# EAGLE design vending machine (EAGLE 9.6.2)
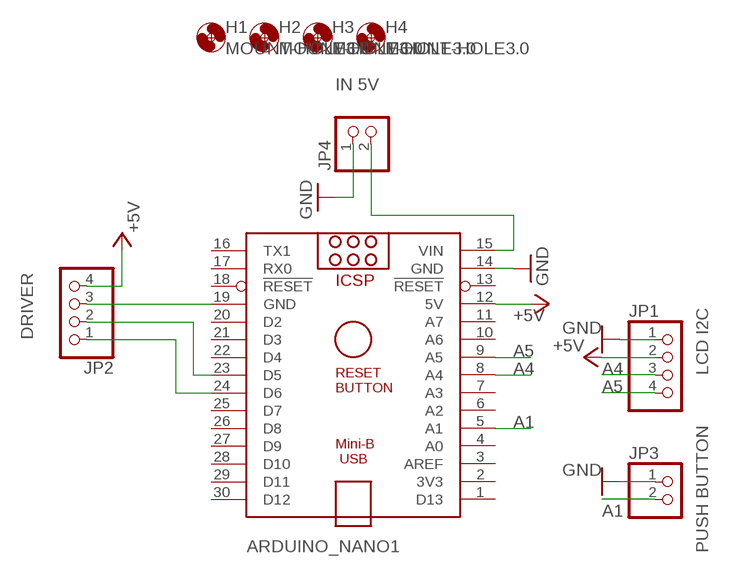
[diagram p0: schematic, sheet 1]

## Parts
ARDUINO_NANO1  ARDUINO_NANO  [ARDUINO_NANO]
H1  MOUNT-HOLE3.0  [3,0]
H2  MOUNT-HOLE3.0  [3,0]
H3  MOUNT-HOLE3.0  [3,0]
H4  MOUNT-HOLE3.0  [3,0]
JP1  PINHD-1X4  [1X04]
JP2  PINHD-1X4  [1X04]
JP3  PINHD-1X2  [1X02]
JP4  PINHD-1X2  [1X02]

## Nets
+5V: ARDUINO_NANO1.12(5V) JP1.2 JP2.4
A1: ARDUINO_NANO1.5(A1) JP3.2
A4: ARDUINO_NANO1.8(A4) JP1.3
A5: ARDUINO_NANO1.9(A5) JP1.4
GND: ARDUINO_NANO1.14(GND) JP1.1 JP3.1 JP4.1
N$1: ARDUINO_NANO1.19(GND) JP2.3
N$2: ARDUINO_NANO1.15(VIN) JP4.2
N$3: ARDUINO_NANO1.23(D5) JP2.2
N$4: ARDUINO_NANO1.24(D6) JP2.1
Unconnected: ARDUINO_NANO1.1(D13) ARDUINO_NANO1.2(3V3) ARDUINO_NANO1.3(AREF) ARDUINO_NANO1.4(A0) ARDUINO_NANO1.6(A2) ARDUINO_NANO1.7(A3) ARDUINO_NANO1.10(A6) ARDUINO_NANO1.11(A7) ARDUINO_NANO1.13(!RESET) ARDUINO_NANO1.16(TX1) ARDUINO_NANO1.17(RX0) ARDUINO_NANO1.18(!RESET) ARDUINO_NANO1.20(D2) ARDUINO_NANO1.21(D3) ARDUINO_NANO1.22(D4) ARDUINO_NANO1.25(D7) ARDUINO_NANO1.26(D8) ARDUINO_NANO1.27(D9) ARDUINO_NANO1.28(D10) ARDUINO_NANO1.29(D11) ARDUINO_NANO1.30(D12)

## Notes on the sheet
- IN 5V
- DRIVER
- LCD I2C
- PUSH BUTTON

## Library data of the parts
ARDUINO_NANO1 = ArduinoNanoV30:ARDUINO_NANO: Arduino Nano V3.0 Overview: The Arduino Nano is a small, complete, and breadboard-friendly board based on the ATmega328 (Arduino Nano 3.x) or ATmega168 (Arduino Nano 2.x). It has more or less the same functionality of the Arduino Duemilanove, but in a different package. It lacks only a DC power jack, and works with a Mini-B USB cable instead of a standard one. The Nano was designed and is being produced by Gravitech. Specifications: Microcontroller Atmel ATmega168 or ATmega328 Operating Voltage (logic level) 5 V Input Voltage (recommended) 7-12 V Input Voltage (limits) 6-20 V Digital I/O Pins 14 (of which 6 provide PWM output) Analog Input Pins 8 DC Current per I/O Pin 40 mA Flash Memory 16 KB (ATmega168) or 32 KB (ATmega328) of which 2 KB used by bootloader SRAM 1 KB (ATmega168) or 2 KB (ATmega328) EEPROM 512 bytes (ATmega168) or 1 KB (ATmega328) Clock Speed 16 MHz Dimensions 0.73" x 1.70" Length 45 mm Width 18 mm Weigth 5 g Power: The Arduino Nano can be powered via the Mini-B USB connection, 6-20V unregulated external power supply (pin 30), or 5V regulated external power supply (pin 27). The power source is automatically selected to the highest voltage source. Memory: The ATmega168 has 16 KB of flash memory for storing code (of which 2 KB is used for the bootloader); the ATmega328 has 32 KB, (also with 2 KB used for the bootloader). The ATmega168 has 1 KB of SRAM and 512 bytes of EEPROM (which can be read and written with the EEPROM library); the ATmega328 has 2 KB of SRAM and 1 KB of EEPROM. Input and Output: Each of the 14 digital pins on the Nano can be used as an input or output, using pinMode(), digitalWrite(), and digitalRead() functions. They operate at 5 volts. Each pin can provide or receive a maximum of 40 mA and has an internal pull-up resistor (disconnected by default) of 20-50 kOhms. In addition, some pins have specialized functions. Visit Arduino - ArduinoBoardNano <https://www.arduino.cc/en/Main/ArduinoBoardNano>
H1-H4 = holes:MOUNT-HOLE: MOUNTING HOLE with drill center marker
JP1 JP2 = pinhead:PINHD-1X4: PIN HEADER
JP3 JP4 = pinhead:PINHD-1X2: PIN HEADER

## Board
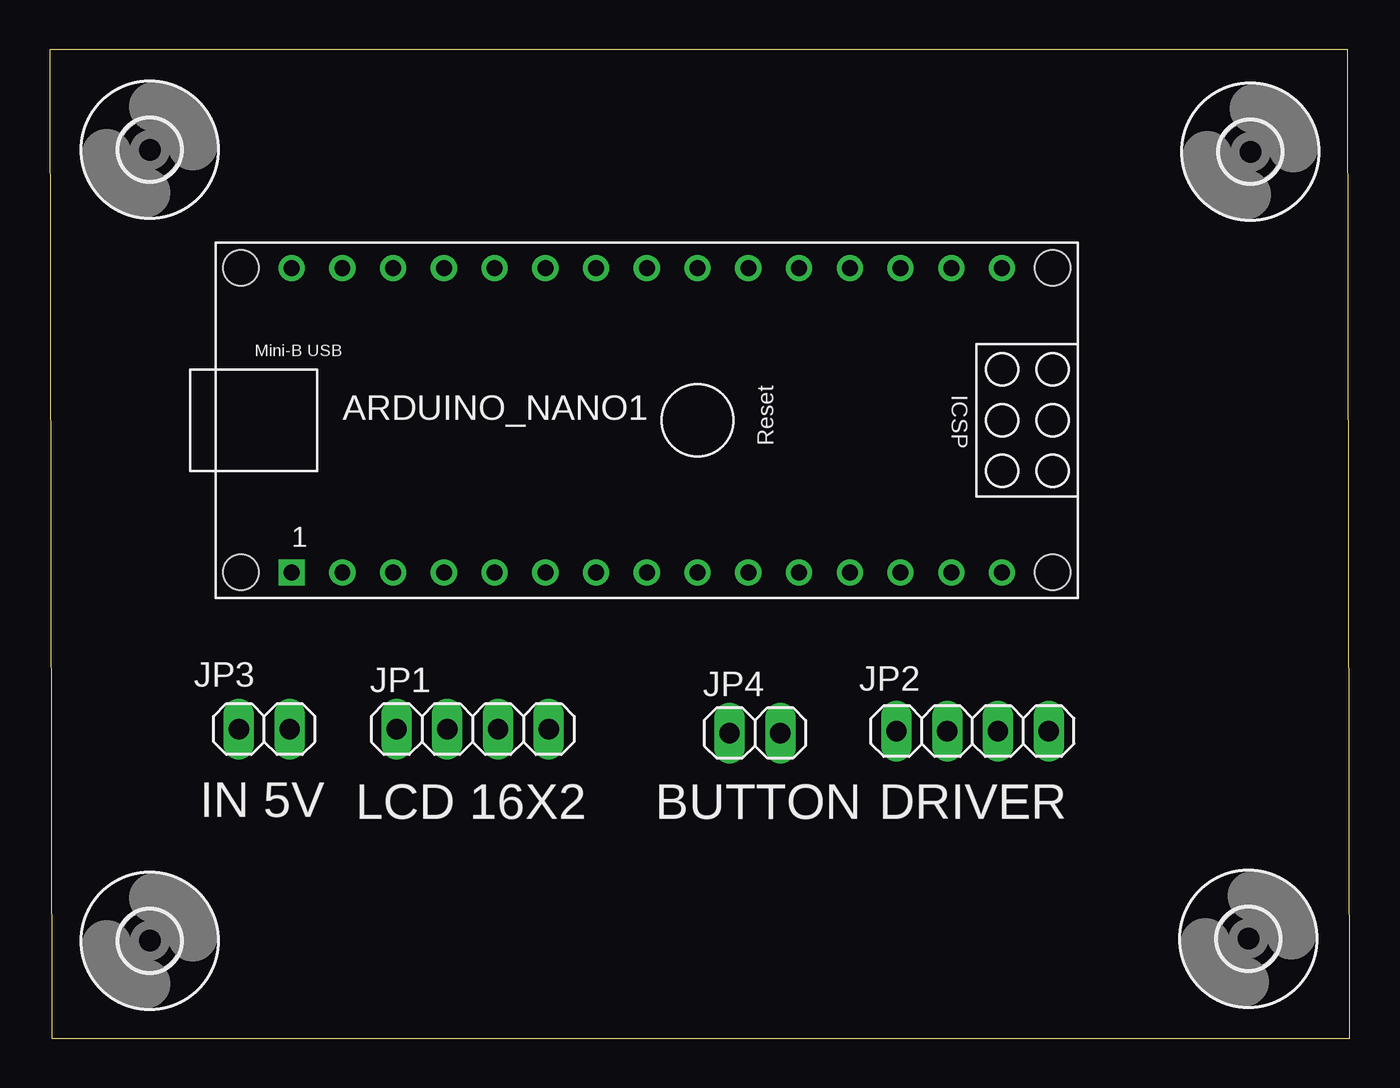
[diagram p1: board, top side]
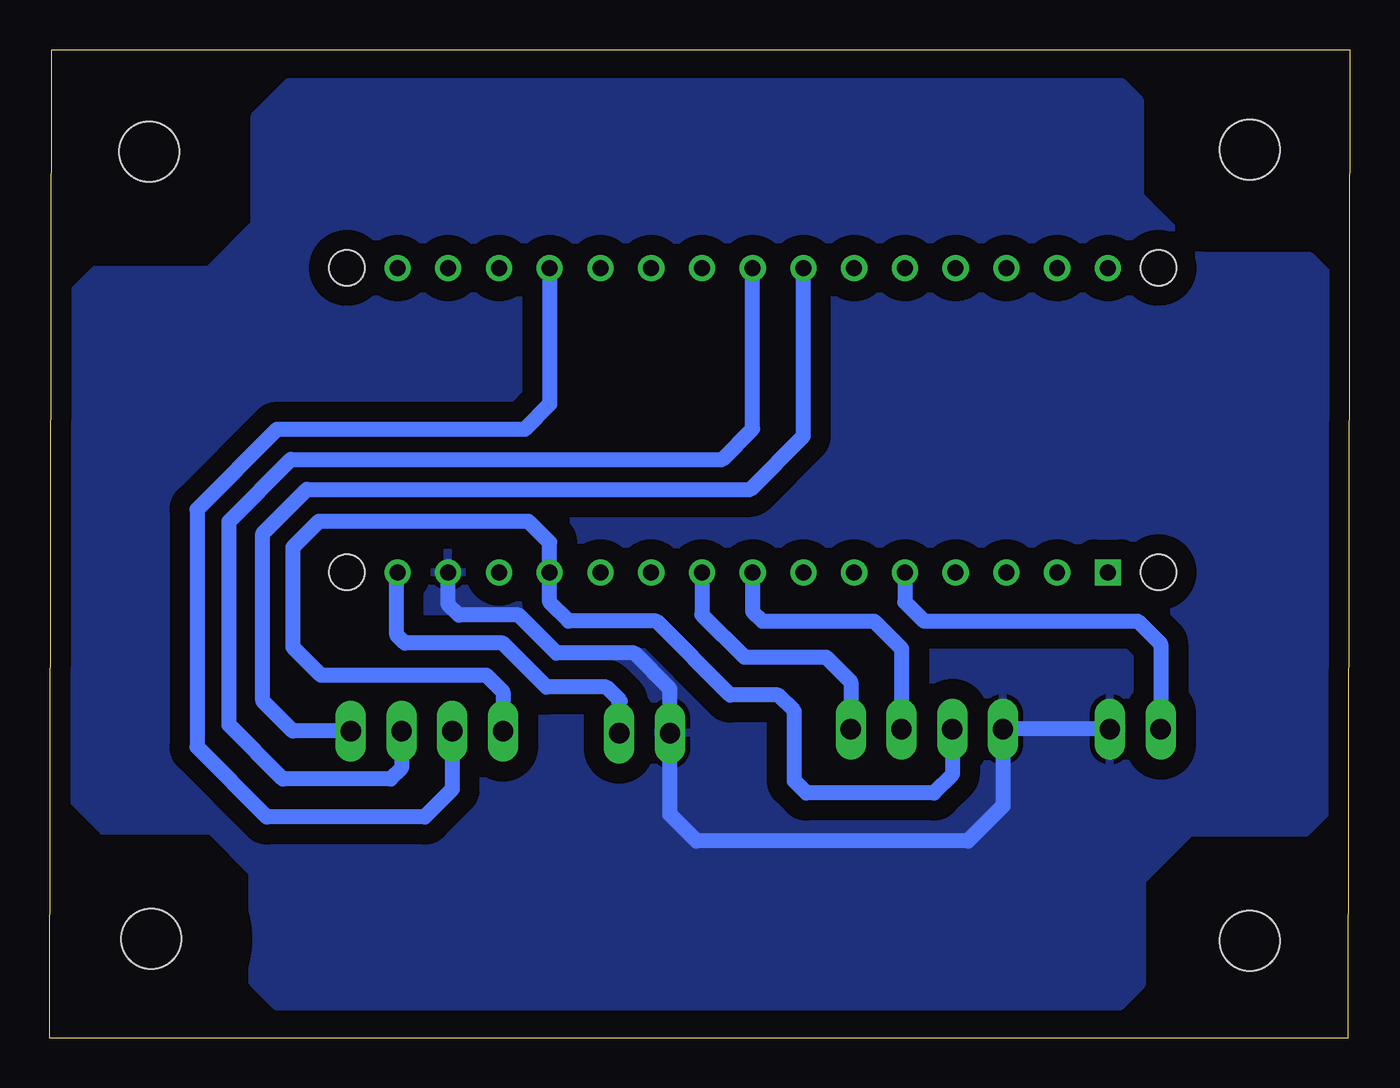
[diagram p2: board, bottom side, seen from below]

Size 65.06 x 49.47 mm. Coordinates in mm from the lower left corner, seen from the top.
Outline: 0.1,0 65.06,0 64.96,49.47 0,49.47 0.1,0
Copper layers (1*16): Top 0.035mm / dielectric 1.5mm / Bottom 0.035mm
Design rules "default": minimum track width 6mil, minimum drill 0.35mm, track to track 12mil, track to pad 12mil, pad to pad 12mil, via to via 6mil, smd to smd 12mil, copper to edge 24mil, drill to drill 6mil, minimum pad ring 10mil, minimum via ring 8mil, stop-mask expansion 4mil, vias tented up to drill 0mil, thermal gap 10mil

### Footprints (pad centres in the part's own frame; a part is rotated, then mirrored left to right if it is on the bottom)
ARDUINO_NANO = drill 0.8 square: 1 -20.32,-7.62 | drill 0.8: 2 -17.78,-7.62; 3 -15.24,-7.62; 4 -12.7,-7.62; 5 -10.16,-7.62; 6 -7.62,-7.62; 7 -5.08,-7.62; 8 -2.54,-7.62; 9 0,-7.62; 10 2.54,-7.62; 11 5.08,-7.62; 12 7.62,-7.62; 13 10.16,-7.62; 14 12.7,-7.62; 15 15.24,-7.62; 16 15.24,7.62; 17 12.7,7.62; 18 10.16,7.62; 19 7.62,7.62; 20 5.08,7.62; 21 2.54,7.62; 22 0,7.62; 23 -2.54,7.62; 24 -5.08,7.62; 25 -7.62,7.62; 26 -10.16,7.62; 27 -12.7,7.62; 28 -15.24,7.62; 29 -17.78,7.62; 30 -20.32,7.62 | hole 1.778: -22.86,-7.62; -22.86,7.62; 17.78,7.62; 17.78,-7.62
3,0 = hole 3: 0,0
1X04 = drill 1.016 long: 1 -3.81,0; 2 -1.27,0; 3 1.27,0; 4 3.81,0
1X02 = drill 1.016 long: 1 -1.27,0; 2 1.27,0

### Placement (x,y rotation side)
ARDUINO_NANO1  32.42,30.93 0 top
H1  5,44.47 0 top
H2  5,4.87 0 top
H3  60,4.97 0 top
H4  60.1,44.37 0 top
JP1  21.16,15.47 0 top
JP2  46.19,15.37 180 top
JP3  10.73,15.47 180 top
JP4  35.29,15.27 0 top

### Tracks (layer width: path | path; a pad name or v marks a point on that pad's centre or on a via)
+5V
  Bottom 0.75: JP1.2 19.89,13.18 20.8,12.27 27.2,12.27 27.8,12.87 27.8,16.37 28.6,17.17 31,17.17 34.7,20.87 39.1,20.87 40.04,21.81 ARDUINO_NANO1.12 40.04,24.81 41.1,25.87 51.6,25.87 52.9,24.57 52.9,19.57 51.5,18.17 43.22,18.17 42.38,17.33 JP2.4
A1
  Bottom 0.75: JP3.2 9.46,19.73 10.6,20.87 21.3,20.87 22.26,21.83 ARDUINO_NANO1.5
A4
  Bottom 0.75: JP1.3 22.43,19.5 23.8,20.87 29.4,20.87 29.88,21.35 ARDUINO_NANO1.8
A5
  Bottom 0.75: ARDUINO_NANO1.9 32.42,21.19 30.3,19.07 26.2,19.07 24.97,17.84 JP1.4
GND
  Bottom 0.75: JP3.1 JP1.1 17.35,11.62 19.1,9.87 32.7,9.87 34.02,11.19 JP4.1 34.02,17.49 35.8,19.27 39.7,19.27 41.6,21.17 44.6,21.17 45.12,21.69 ARDUINO_NANO1.14
  pour Bottom (isolate 1): 0.8,11.67 2.2,10.27 8,10.27 10.4,7.87 10.4,2.67 11.5,1.57 53.7,1.57 54.9,2.77 54.9,8.27 57,10.37 62.4,10.37 64,11.97 64,37.27 62.8,38.47 57.1,38.47 54.8,40.77 54.8,46.17 53.1,47.87 11.4,47.87 10.5,46.97 10.5,42.17 7.5,39.17 2,39.17 0.8,37.97
N$1
  Bottom 0.75: JP2.3 44.92,12.45 46.3,11.07 54.2,11.07 57.7,14.57 57.7,26.47 53.7,30.47 41.3,30.47 40.04,31.73 ARDUINO_NANO1.19
N$2
  Bottom 0.75: 36.76,15.47 JP4.2 36.56,16.81 36.5,16.87 37.2,17.57 40.2,17.57 42.4,19.77 47.3,19.77 47.7,20.17 47.7,23.27 ARDUINO_NANO1.15
N$3
  Bottom 0.75: JP2.2 47.46,13.51 48,12.97 53.4,12.97 56.1,15.67 56.1,25.87 53,28.97 31.4,28.97 29.88,30.49 ARDUINO_NANO1.23
N$4
  Bottom 0.75: JP2.1 52.9,15.37 54.4,16.87 54.4,25.27 52.2,27.47 30,27.47 27.34,30.13 ARDUINO_NANO1.24

### Text on the board
tNames: IN 5V | LCD 16X2 | BUTTON | DRIVER